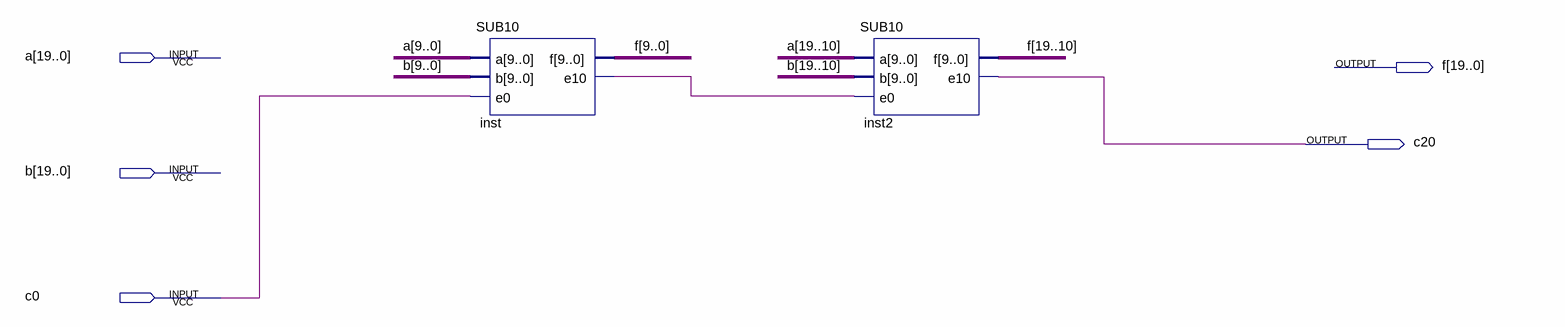
[diagram p0: schematic sheet]
// Quartus schematic SUB20.bdf as structural Verilog: 2 symbols, 5 pins
module SUB20 (
  input  [19:0] a,
  input  [19:0] b,
  input  c0,
  output [19:0] f,
  output c20
);

  wire inst_e10;

  SUB10 inst (.a(a[9:0]), .b(b[9:0]), .e0(c0), .f(f[9:0]), .e10(inst_e10));
  SUB10 inst2 (.a(a[19:10]), .b(b[19:10]), .e0(inst_e10), .f(f[19:10]), .e10(c20));
endmodule
